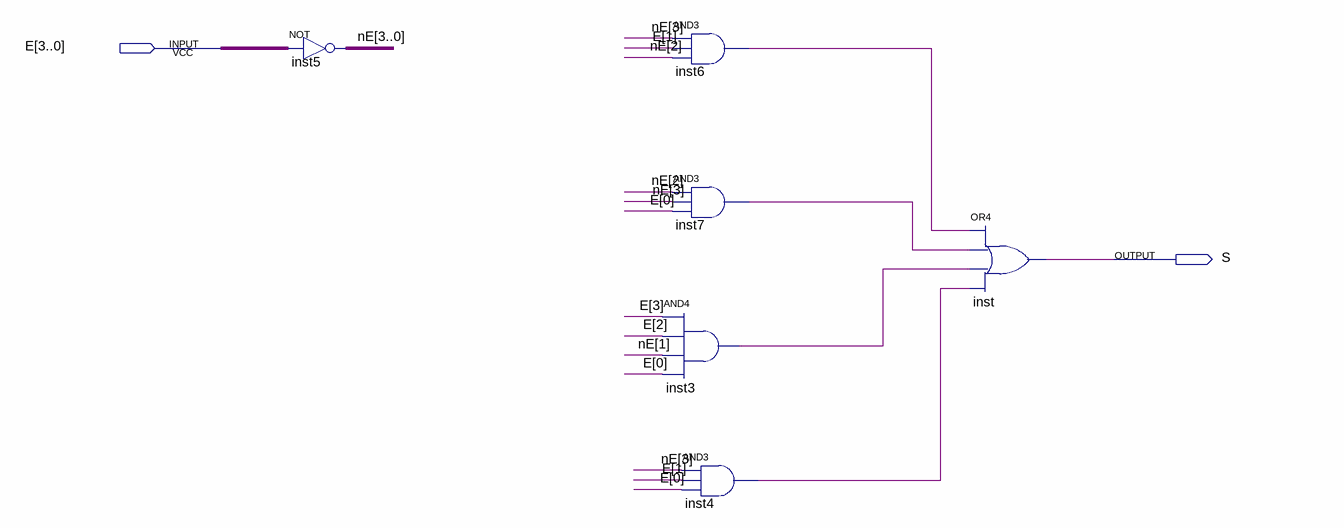
[diagram p0: schematic sheet]
// Quartus schematic ledF.bdf as structural Verilog: 6 symbols, 2 pins
module ledF (
  input  [3:0] E,
  output S
);

  wire inst3_out, inst4_out, inst6_out, inst7_out;
  wire [3:0] nE;

  assign nE = ~E;  // NOT inst5, 4 bits wide
  and inst6 (inst6_out, nE[3], E[1], nE[2]);
  and inst7 (inst7_out, nE[2], nE[3], E[0]);
  and inst3 (inst3_out, E[3], E[2], nE[1], E[0]);
  and inst4 (inst4_out, nE[3], E[1], E[0]);
  or inst (S, inst6_out, inst7_out, inst3_out, inst4_out);
endmodule
